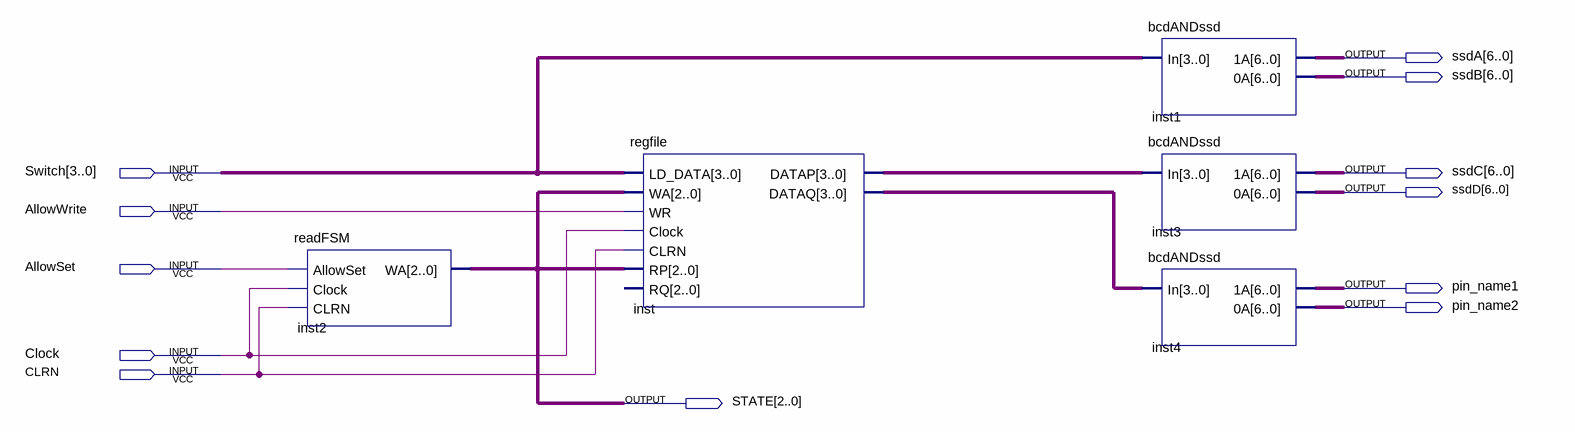
[diagram p0: schematic sheet]
// Quartus schematic FinalProj.bdf as structural Verilog: 5 symbols, 12 pins
module FinalProj (
  input  [3:0] Switch,
  input  AllowWrite,
  input  AllowSet,
  input  Clock,
  input  CLRN,
  output [6:0] ssdA,
  output [6:0] ssdB,
  output [6:0] ssdC,
  output [6:0] ssdD,
  output pin_name1,
  output pin_name2,
  output [2:0] STATE
);

  wire [3:0] inst_datap, inst_dataq;
  wire [6:0] inst4_0a, inst4_1a;

  readFSM inst2 (.AllowSet(AllowSet), .Clock(Clock), .CLRN(CLRN), .WA(STATE));
  regfile inst (
    .LD_DATA(Switch), .WA(STATE), .WR(AllowWrite), .Clock(Clock), .CLRN(CLRN), .RP(STATE),
    .DATAP(inst_datap), .DATAQ(inst_dataq));  // open: RQ
  bcdANDssd inst1 (.In(Switch), .\1A (ssdA), .\0A (ssdB));
  bcdANDssd inst3 (.In(inst_datap), .\1A (ssdC), .\0A (ssdD));
  bcdANDssd inst4 (.In(inst_dataq), .\1A (inst4_1a), .\0A (inst4_0a));
endmodule
